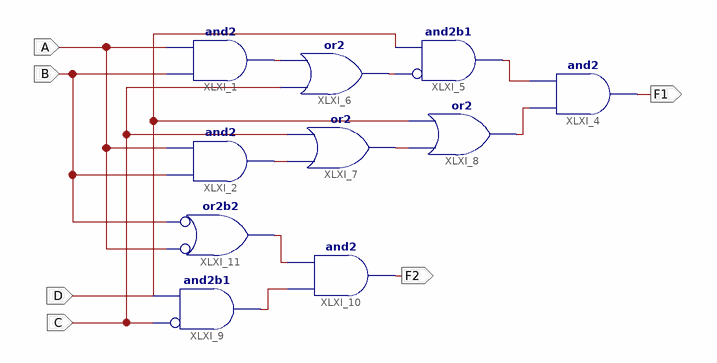
[diagram p0: schematic sheet 1]
// Xilinx ISE schematic Prob_1.sch (spartan3e) as structural Verilog: 10 symbols, 6 ports
module Prob_1 (
  input  B,
  input  D,
  input  C,
  input  A,
  output F1,
  output F2
);

  wire XLXN_1, XLXN_2, XLXN_3, XLXN_4, XLXN_5, XLXN_18, XLXN_36, XLXN_57;

  and XLXI_1 (XLXN_2, B, A);
  and XLXI_2 (XLXN_3, B, A);
  and XLXI_4 (F1, XLXN_18, XLXN_1);
  and XLXI_5 (XLXN_1, ~XLXN_4, D);  // and2b1
  or XLXI_6 (XLXN_4, C, XLXN_2);
  or XLXI_7 (XLXN_5, XLXN_3, C);
  or XLXI_8 (XLXN_18, XLXN_5, D);
  and XLXI_9 (XLXN_36, ~C, D);  // and2b1
  and XLXI_10 (F2, XLXN_36, XLXN_57);
  or XLXI_11 (XLXN_57, ~A, ~B);  // or2b2
endmodule
